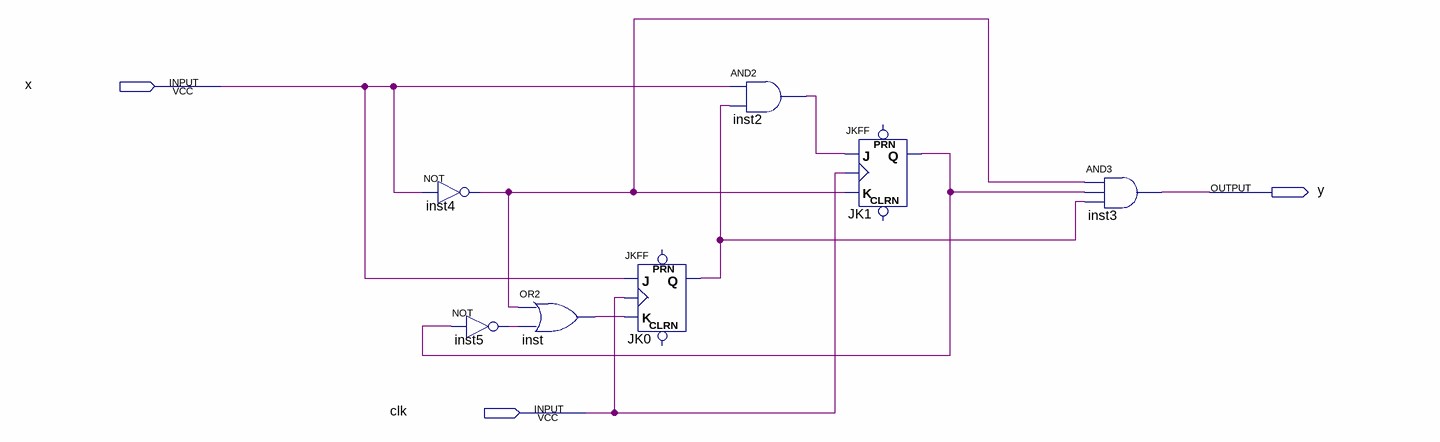
[diagram p0: schematic sheet]
// Quartus schematic state_mealy.bdf as structural Verilog: 7 symbols, 3 pins
module state_mealy (
  input  x,
  input  clk,
  output y
);

  wire inst2_out, inst4_out, inst5_out, inst_out, JK0_q, JK1_q;

  not inst4 (inst4_out, x);
  not inst5 (inst5_out, JK1_q);
  or inst (inst_out, inst4_out, inst5_out);
  JKFF JK0 (.K(inst_out), .J(x), .CLK(clk), .Q(JK0_q));  // open: PRN, CLRN
  and inst2 (inst2_out, x, JK0_q);
  JKFF JK1 (.K(inst4_out), .J(inst2_out), .CLK(clk), .Q(JK1_q));  // open: PRN, CLRN
  and inst3 (y, inst4_out, JK1_q, JK0_q);
endmodule
